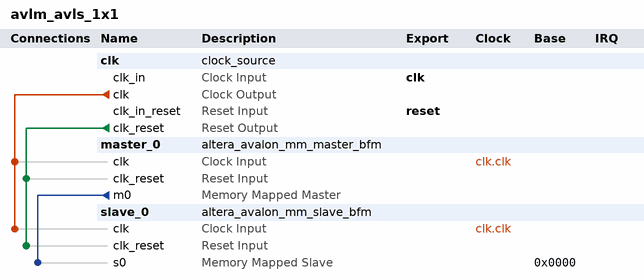
[diagram p0: system contents]
# Platform Designer (Qsys) system avlm_avls_1x1, Cyclone V 5CSEMA4U23C6
# Parameters at their usual value, and those the tool derives, are not listed.
package require -exact qsys 15.1
create_system avlm_avls_1x1
set_project_property DEVICE_FAMILY {Cyclone V}
set_project_property DEVICE 5CSEMA4U23C6

add_instance clk clock_source 15.1
set_instance_parameter_value clk clockFrequency 50000000
set_instance_parameter_value clk resetSynchronousEdges DEASSERT

add_instance master_0 altera_avalon_mm_master_bfm 15.1
set_instance_parameter_value master_0 ADDRESS_UNITS SYMBOLS
set_instance_parameter_value master_0 AV_ADDRESS_W 12
set_instance_parameter_value master_0 AV_ALWAYS_BURST_MAX_BURST 0
set_instance_parameter_value master_0 AV_BURSTCOUNT_W 4
set_instance_parameter_value master_0 AV_BURST_BNDR_ONLY 0
set_instance_parameter_value master_0 AV_BURST_LINEWRAP 0
set_instance_parameter_value master_0 AV_CONSTANT_BURST_BEHAVIOR 1
set_instance_parameter_value master_0 AV_FIX_READ_LATENCY 1
set_instance_parameter_value master_0 AV_MAX_PENDING_READS 8
set_instance_parameter_value master_0 AV_MAX_PENDING_WRITES 0
set_instance_parameter_value master_0 AV_NUMSYMBOLS 4
set_instance_parameter_value master_0 AV_READRESPONSE_W 8
set_instance_parameter_value master_0 AV_READ_WAIT_TIME 1
set_instance_parameter_value master_0 AV_WRITERESPONSE_W 8
set_instance_parameter_value master_0 USE_BURSTCOUNT 1
set_instance_parameter_value master_0 USE_BYTE_ENABLE 1
set_instance_parameter_value master_0 USE_READ 1
set_instance_parameter_value master_0 USE_READ_DATA 1
set_instance_parameter_value master_0 USE_READ_DATA_VALID 1
set_instance_parameter_value master_0 USE_WAIT_REQUEST 1
set_instance_parameter_value master_0 VHDL_ID 0

add_instance slave_0 altera_avalon_mm_slave_bfm 15.1
set_instance_parameter_value slave_0 ADDRESS_UNITS SYMBOLS
set_instance_parameter_value slave_0 ASSERT_HIGH_ARBITERLOCK 1
set_instance_parameter_value slave_0 ASSERT_HIGH_BYTEENABLE 1
set_instance_parameter_value slave_0 ASSERT_HIGH_LOCK 1
set_instance_parameter_value slave_0 ASSERT_HIGH_READ 1
set_instance_parameter_value slave_0 ASSERT_HIGH_READDATAVALID 1
set_instance_parameter_value slave_0 ASSERT_HIGH_RESET 1
set_instance_parameter_value slave_0 ASSERT_HIGH_WAITREQUEST 1
set_instance_parameter_value slave_0 ASSERT_HIGH_WRITE 1
set_instance_parameter_value slave_0 AV_ADDRESS_W 12
set_instance_parameter_value slave_0 AV_BURSTCOUNT_W 4
set_instance_parameter_value slave_0 AV_BURST_BNDR_ONLY 0
set_instance_parameter_value slave_0 AV_BURST_LINEWRAP 0
set_instance_parameter_value slave_0 AV_FIX_READ_LATENCY 0
set_instance_parameter_value slave_0 AV_MAX_PENDING_READS 8
set_instance_parameter_value slave_0 AV_MAX_PENDING_WRITES 0
set_instance_parameter_value slave_0 AV_NUMSYMBOLS 4
set_instance_parameter_value slave_0 AV_READRESPONSE_W 8
set_instance_parameter_value slave_0 AV_READ_WAIT_TIME 1
set_instance_parameter_value slave_0 AV_REGISTERINCOMINGSIGNALS 0
set_instance_parameter_value slave_0 AV_SYMBOL_W 8
set_instance_parameter_value slave_0 AV_WRITERESPONSE_W 8
set_instance_parameter_value slave_0 AV_WRITE_WAIT_TIME 0
set_instance_parameter_value slave_0 REGISTER_WAITREQUEST 0
set_instance_parameter_value slave_0 USE_ADDRESS 1
set_instance_parameter_value slave_0 USE_ARBITERLOCK 0
set_instance_parameter_value slave_0 USE_BEGIN_BURST_TRANSFER 0
set_instance_parameter_value slave_0 USE_BEGIN_TRANSFER 0
set_instance_parameter_value slave_0 USE_BURSTCOUNT 1
set_instance_parameter_value slave_0 USE_BYTE_ENABLE 1
set_instance_parameter_value slave_0 USE_CLKEN 0
set_instance_parameter_value slave_0 USE_DEBUGACCESS 0
set_instance_parameter_value slave_0 USE_LOCK 0
set_instance_parameter_value slave_0 USE_READ 1
set_instance_parameter_value slave_0 USE_READRESPONSE 0
set_instance_parameter_value slave_0 USE_READ_DATA 1
set_instance_parameter_value slave_0 USE_READ_DATA_VALID 1
set_instance_parameter_value slave_0 USE_TRANSACTIONID 0
set_instance_parameter_value slave_0 USE_WAIT_REQUEST 1
set_instance_parameter_value slave_0 USE_WRITE 1
set_instance_parameter_value slave_0 USE_WRITERESPONSE 0
set_instance_parameter_value slave_0 USE_WRITE_DATA 1
set_instance_parameter_value slave_0 VHDL_ID 0

# connections
add_connection clk.clk master_0.clk clock
add_connection clk.clk slave_0.clk clock
add_connection clk.clk_reset master_0.clk_reset reset
add_connection clk.clk_reset slave_0.clk_reset reset
add_connection master_0.m0 slave_0.s0 avalon
set_connection_parameter_value master_0.m0/slave_0.s0 baseAddress 0x0000

# exported interfaces
add_interface clk clock sink
set_interface_property clk EXPORT_OF clk.clk_in
add_interface reset reset sink
set_interface_property reset EXPORT_OF clk.clk_in_reset

set_interconnect_requirement {$system} qsys_mm.clockCrossingAdapter HANDSHAKE
set_interconnect_requirement {$system} qsys_mm.insertDefaultSlave FALSE
set_interconnect_requirement {$system} qsys_mm.maxAdditionalLatency 1

save_system avlm_avls_1x1.qsys
